# EAGLE schematic USB (EAGLE 7.4.0)
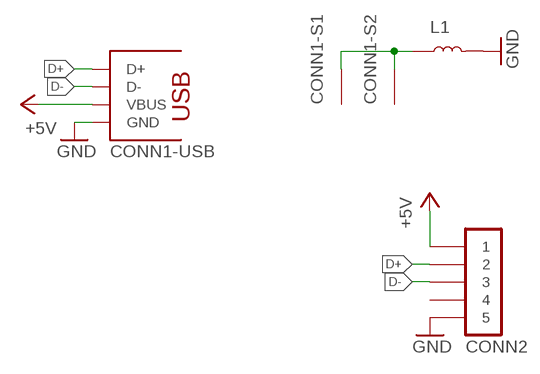
[diagram p0: schematic, sheet 1]

## Parts
CONN1  USB-V  [USB-B-PTH-V]
CONN2  PINHD-1X05-JST-XH-H  [JST-XH-05P-H]
L1  FERRITE_BEAD-BLM21PG221SN1D  [L0805]

## Nets
+5V: CONN1.VBUS(-USB:VBUS) CONN2.1
D+: CONN1.D+(-USB:D+) CONN2.2
D-: CONN1.D-(-USB:D-) CONN2.3
GND: CONN1.GND(-USB:GND) CONN2.5 L1.2
N$1: CONN1.S1(-S1:S) CONN1.S2(-S2:S) L1.1
Unconnected: CONN2.4

## Library data of the parts
CONN1 = igor_lbr:USB: USB B connector, horizontal; MANUFACTURER: CUI Devices; MPN: UJ2-BV-1-TH
CONN2 = igor_lbr:PINHD-1X05: Pin Header
L1 = igor_lbr:FERRITE_BEAD: Ferrite Bead; MANUFACTURER: Murata; MPN: BLM21PG221SN1D